# EAGLE design schematic1 (EAGLE 9.6.2)

## Sheet 1 of 2
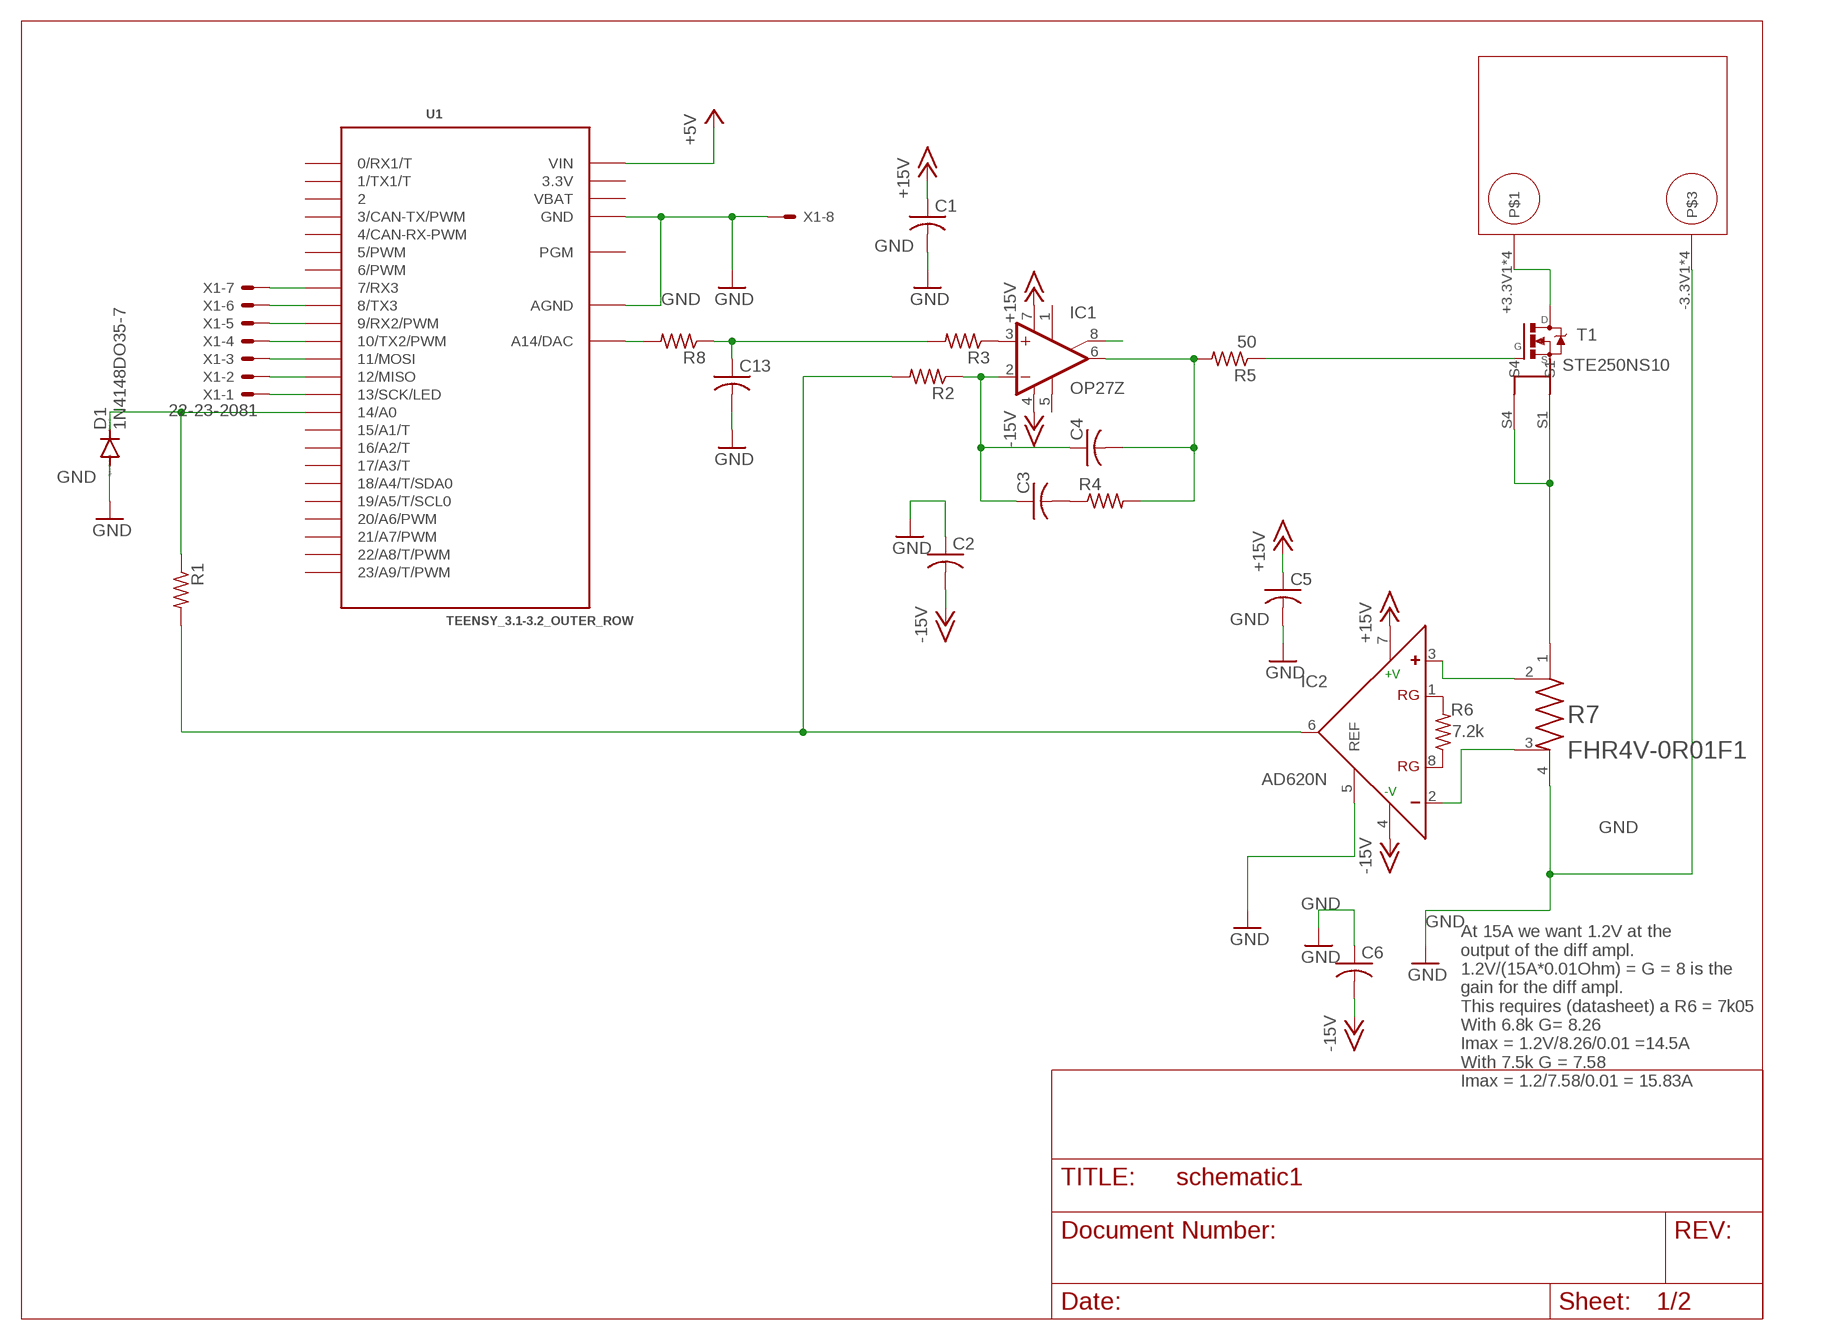
[diagram p0: schematic, sheet 1]

### Parts
C1  C-US025-024X044  [C025-024X044]
C2  C-US025-024X044  [C025-024X044]
C3  C-US025-024X044  [C025-024X044]
C4  C-US025-024X044  [C025-024X044]
C5  C-US025-024X044  [C025-024X044]
C6  C-US025-024X044  [C025-024X044]
C13  C-US025-024X044  [C025-024X044]
D1  1N4148DO35-7  [DO35-7]
IC1  OP27Z  [DIL08]
IC2  AD620N  [DIL08]
J1  MOLEX_0399200502  [3.3V_HOOKIN]
R1  R-US_0204/7  [0204/7]
R2  R-US_0204/7  [0204/7]
R3  R-US_0204/7  [0204/7]
R4  R-US_0204/7  [0204/7]
R5  50  R-US_0204/7  [0204/7]
R6  7.2k  R-US_0204/7  [0204/7]
R7  FHR4V-0R01F1  FHR4V-0R1F1  [RIEDON_FHR4V-0R1F1]
R8  R-US_0204/7  [0204/7]
T1  STE250NS10  [STE250NS10]
U1  TEENSY_3.1-3.2_OUTER_ROW  [TEENSY_3.0-3.2&LC_OUTER_ROW]
X1  22-23-2081  [22-23-2081]

### Nets
+5V: U1.VIN ; also sheet 2
+15V: C1.1 C5.1 IC1.7(V+) IC2.7(+V) ; also sheet 2
-15V: C2.2 C6.2 IC1.4(V-) IC2.4(-V) ; also sheet 2
GND: C1.2 C2.1 C5.2 C6.1 C13.2 D1.A IC2.5(REF) J1.-3.3V1 J1.-3.3V2 J1.-3.3V3 J1.-3.3V4 R7.4 U1.AGND U1.GND U1.GND1(GND) X1.8 ; also sheet 2
N$1: U1.7(7/RX3) X1.7
N$2: J1.+3.3V1 J1.+3.3V2 J1.+3.3V3 J1.+3.3V4 T1.D
N$3: D1.C R1.1 U1.14/A0
N$4: IC2.1(RG) R6.2
N$5: IC2.8(RG) R6.1
N$6: U1.8(8/TX3) X1.6
N$7: IC2.6(OUT) R1.2 R2.2
N$8: C3.1 C4.1 IC1.2(-IN) R2.1
N$9: IC1.3(+IN) R3.1
N$10: R8.2 U1.RESET/DAC(A14/DAC)
N$11: C4.2 IC1.6(OUT) R4.2 R5.2
N$12: R5.1 T1.G
N$13: C3.2 R4.1
N$14: C13.1 R3.2 R8.1
N$15: IC1.8(ON2)
N$16: U1.9(9/RX2/PWM) X1.5
N$17: R7.1 T1.S1 T1.S4
N$18: IC2.3(+) R7.2
N$19: IC2.2(-) R7.3
N$20: U1.10(10/TX2/PWM) X1.4
N$21: U1.11(11/MOSI) X1.3
N$22: U1.12(12/MISO) X1.2
N$23: U1.13(13/SCK/LED) X1.1
Unconnected: IC1.1(ON1) IC1.5(OPT) U1.0(0/RX1/T) U1.1(1/TX1/T) U1.2 U1.3(3/CAN-TX/PWM) U1.4(4/CAN-RX-PWM) U1.5(5/PWM) U1.6(6/PWM) U1.15/A1(15/A1/T) U1.16/A2(16/A2/T) U1.17/A3(17/A3/T) U1.18/A4(18/A4/T/SDA0) U1.19/A5(19/A5/T/SCL0) U1.20/A6(20/A6/PWM) U1.21/A7(21/A7/PWM) U1.22/A8(22/A8/T/PWM) U1.23/A9(23/A9/T/PWM) U1.PGM

### Notes on the sheet
- At 15A we want 1.2V at the
  output of the diff ampl.
  1.2V/(15A*0.01Ohm) = G = 8 is the
  gain for the diff ampl.
  This requires (datasheet) a R6 = 7k05
  With 6.8k G= 8.26
  Imax = 1.2V/8.26/0.01 =14.5A
  With 7.5k G = 7.58
  Imax = 1.2/7.58/0.01 = 15.83A

## Sheet 2 of 2
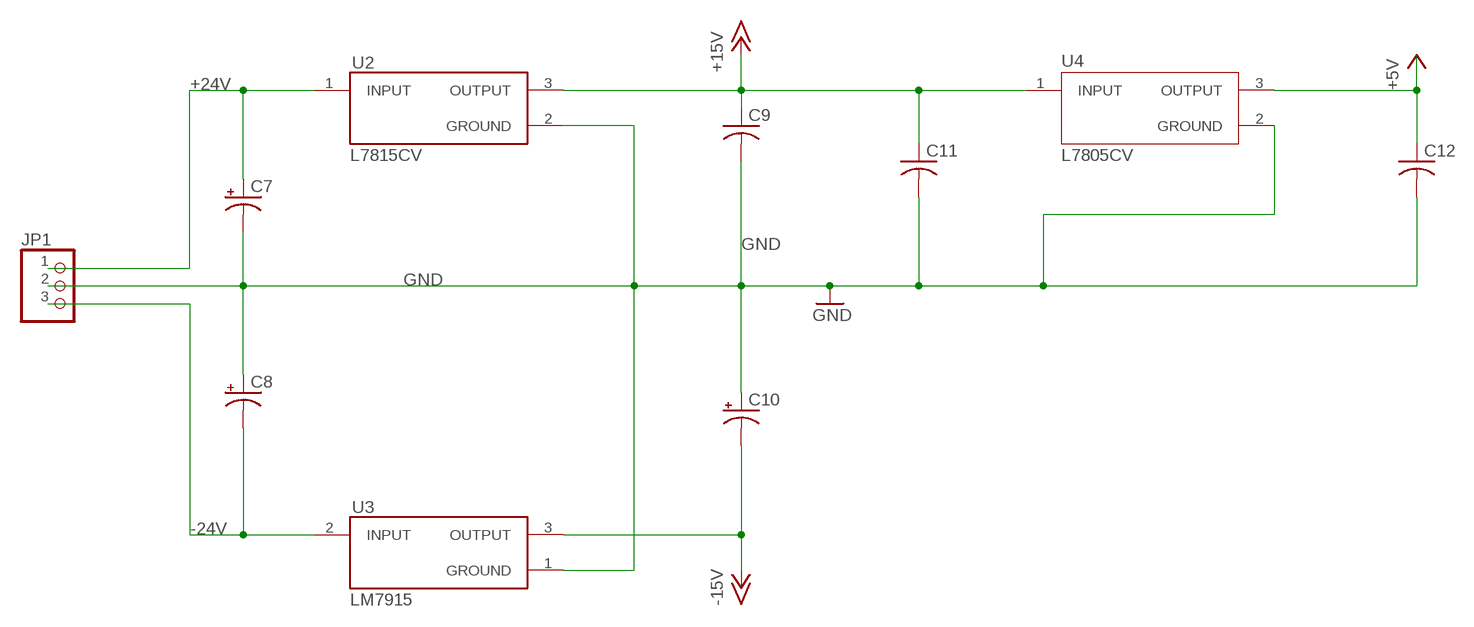
[diagram p1: schematic, sheet 2]

### Parts
C7  CPOL-USTT2D4  [TT2D4]
C8  CPOL-USTT2D4  [TT2D4]
C9  C-US025-024X044  [C025-024X044]
C10  CPOL-USTT2D4  [TT2D4]
C11  C-US025-024X044  [C025-024X044]
C12  C-US025-024X044  [C025-024X044]
JP1  PINHD-1X3  [1X03]
U2  L7815CV  [TO255P1040X460X1935-3]
U3  LM7915  [TO255P1040X460X1935-3]
U4  L7805CV  [TO255P1040X460X1968-3]

### Nets
+5V: C12.1 U4.3(OUTPUT) ; also sheet 1
+15V: C9.1 C11.1 U2.3(OUTPUT) U4.1(INPUT) ; also sheet 1
+24V: C7.+ JP1.1 U2.1(INPUT)
-15V: C10.- U3.3(OUTPUT) ; also sheet 1
-24V: C8.- JP1.3 U3.2(INPUT)
GND: C7.- C8.+ C9.2 C10.+ C11.2 C12.2 JP1.2 U2.2(GROUND) U3.1(GROUND) U4.2(GROUND) ; also sheet 1

## Power pins joined to a net without a drawn wire
3.3V: U1.3.3V U1.3.3V1(3.3V)
VBAT: U1.VBAT

## Library data of the parts
C1-C6 C9 C11-C13 = rcl:C-US: CAPACITOR, American symbol; SPICEPREFIX: C
C7 C8 C10 = rcl:CPOL-US: POLARIZED CAPACITOR, American symbol; SPICEPREFIX: C
D1 = diode:1N4148: DIODE high speed (Philips)
IC1 = schematic1:OP27: OP AMP Check prices <https://pricing.snapeda.com/search/part/OP27/?ref=eda>; AVAILABILITY: Bad; DESCRIPTION: Audio Amplifier 2 Circuit 8-SOIC; MF: Analog Devices; MP: OP27; PACKAGE: SOIC-8 Texas Instruments; PRICE: None
IC2 = schematic1:AD620: Low Cost, Low Power, Instrumentation Amplifier Source: http://www.analog.com/UploadedFiles/Data_Sheets/37793330023930AD620_e.pdf Check prices <https://pricing.snapeda.com/search/part/AD620/?ref=eda>; AVAILABILITY: Bad; DESCRIPTION: Instrumentation Amplifier 1 Circuit 8-SOIC; MF: Analog Devices; MP: AD620; PACKAGE: TSSOP-8 Analog Devices; PRICE: None
J1 = schematic1:MOLEX_0399200502
JP1 = schematic1:PINHD-1X3: PIN HEADER
R1-R6 R8 = rcl:R-US_: RESISTOR, American symbol; SPICEPREFIX: R
R7 = schematic1:FHR4V-0R1F1: RES 0.1 OHM 1% 40W RADIAL Check prices <https://pricing.snapeda.com/search/part/FHR4V-0R1F1/?ref=eda>; AVAILABILITY: Bad; DESCRIPTION: 100 mOhms ±1% 40W Through Hole Resistor 4-SIP Current Sense Metal Foil; MF: Riedon; MP: FHR4V-0R1F1; PACKAGE: SIP-4 Riedon; PRICE: None; PURCHASE-URL: https://pricing.snapeda.com/search/part/FHR4V-0R1F1/?ref=eda
T1 = schematic1:STE250NS10
U1 = schematic1:TEENSY_3.1-3.2_OUTER_ROW: Footprint for Teensy 3.1 or 3.2 board using all pin connections on the outer perimeter
U2 = schematic1:L7815CV: L7815 Series 1.5 A 15 V Fixed Output Three Terminal Voltage Regulator - TO-220 Check prices <https://pricing.snapeda.com/search/part/L7815CV/?ref=eda>; AVAILABILITY: Good; DESCRIPTION: Linear Voltage Regulator IC 1 Output 1.5A TO-220; MF: STMicroelectronics; MP: L7815CV; PACKAGE: TO-220 STMicroelectronics; PRICE: None; PURCHASE-URL: https://pricing.snapeda.com/search/part/L7815CV/?ref=eda
U3 = schematic1:LM7915
U4 = schematic1:L7805CV: Standard Regulator Pos 5V 1.5A 3-Pin(3+Tab) TO-220 Standard Regulator Pos 5V 1.5A 3-Pin(3+Tab) TO-220; AVAILABILITY: Unavailable; DESCRIPTION: Linear Voltage Regulator IC 1 Output 1.5A TO-220; MF: STMicroelectronics; MP: L7805CV; PACKAGE: TO-220 STMicroelectronics; PRICE: None
X1 = schematic1:22-23-2081: .100" (2.54mm) Center Header - 8 Pin; DIGIKEY: ED10566-ND; MF: MOLEX; MPN: 22-23-2081; OC_FARNELL: 1756826; OC_NEWARK: 01C7592

## Board
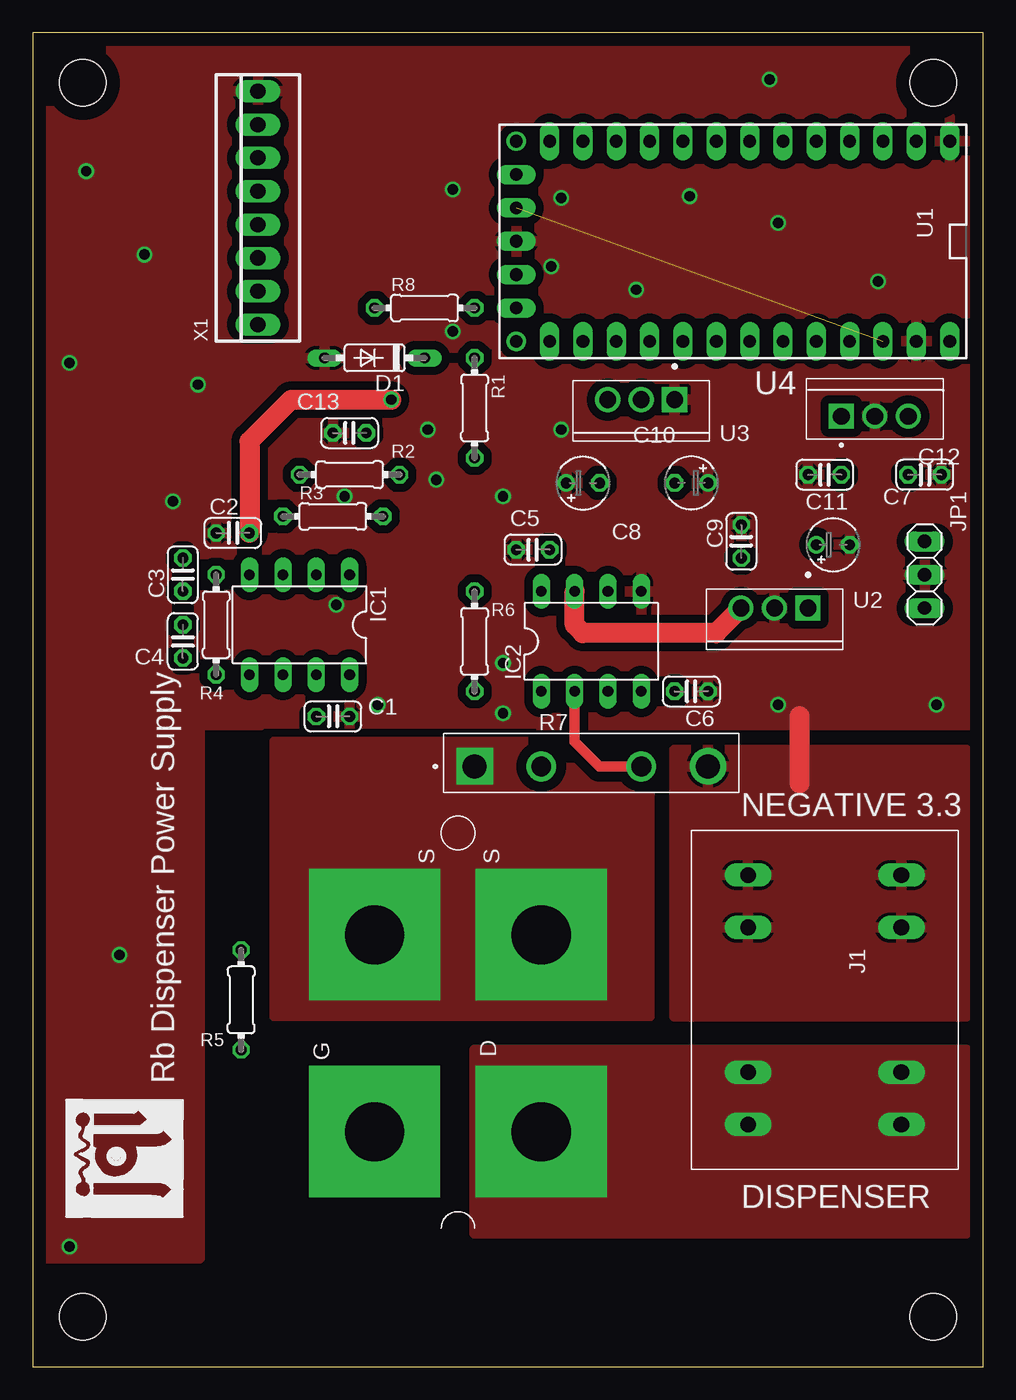
[diagram p2: board, top side]
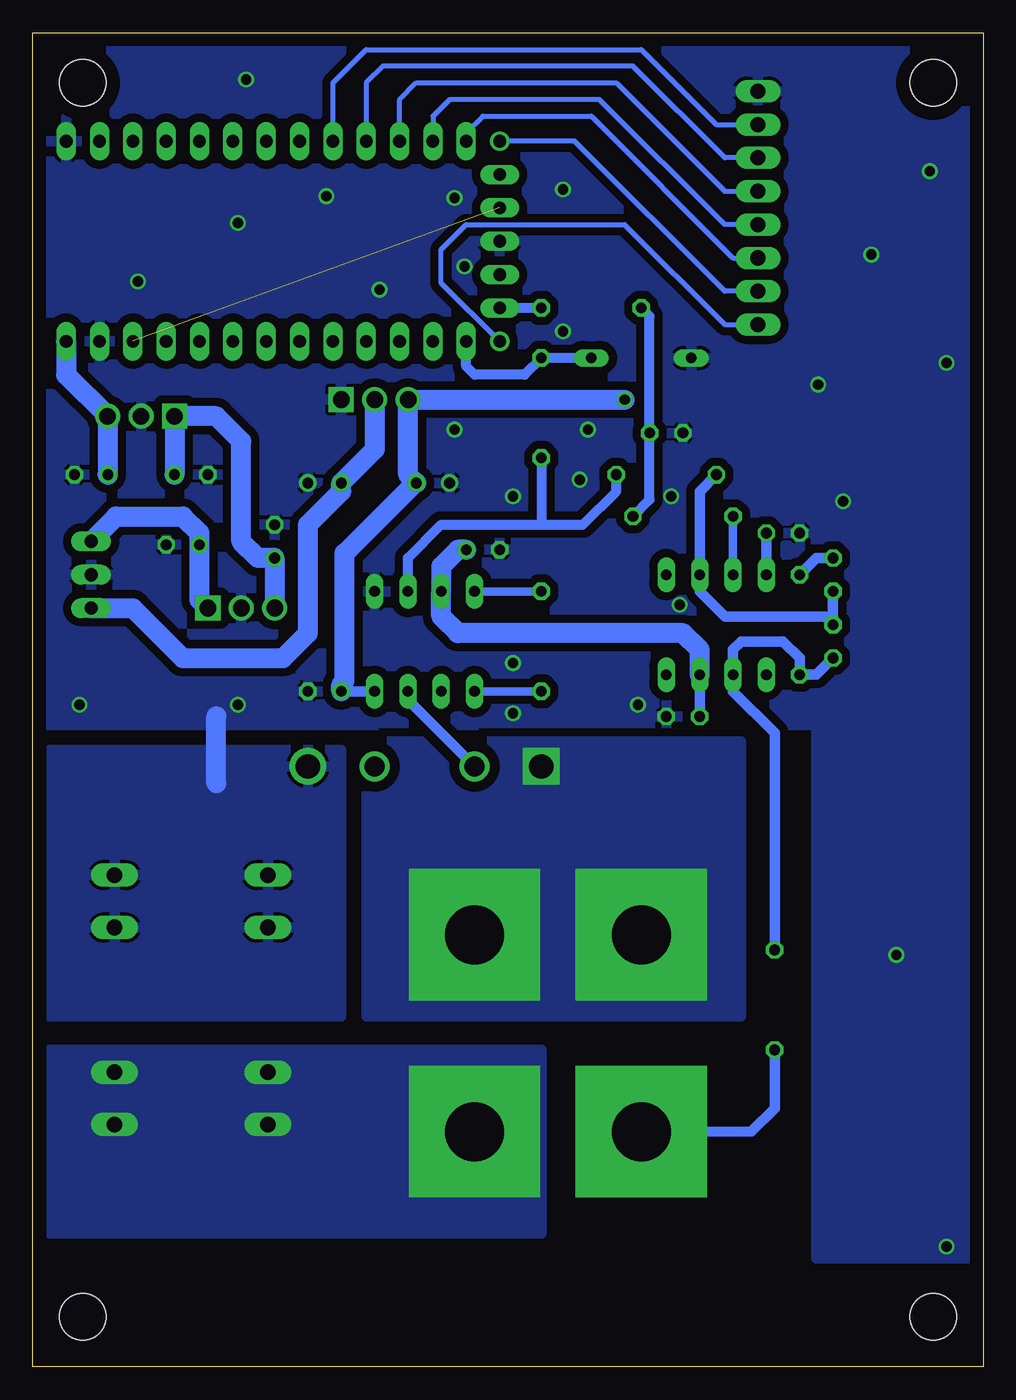
[diagram p3: board, bottom side, seen from below]

Size 72.39 x 101.6 mm. Coordinates in mm from the lower left corner, seen from the top.
Outline: 0,0 72.39,0 72.39,101.6 0,101.6 0,0
Copper layers (1*16): Top 0.035mm / dielectric 1.5mm / Bottom 0.035mm
Design rules "default *": minimum track width 6mil, minimum drill 0.35mm, track to track 10mil, track to pad 10mil, pad to pad 10mil, via to via 10mil, smd to smd 10mil, copper to edge 40mil, drill to drill 6mil, minimum pad ring 10mil, minimum via ring 8mil, stop-mask expansion 4mil, vias tented up to drill 0mil, thermal gap 10mil
Holes 3.56 mm at 3.81,97.79 68.58,97.79 3.81,3.81 68.58,3.81

### Footprints (pad centres in the part's own frame; a part is rotated, then mirrored left to right if it is on the bottom)
C025-024X044 = drill 0.813 octagon: 1 -1.27,0; 2 1.27,0
TT2D4 = drill 0.813: + -1.27,0 | drill 0.813 octagon: - 1.27,0
DO35-7 = drill 0.813 long: A 3.81,0; C -3.81,0
DIL08 = drill 0.813 long: 1 -3.81,-3.81; 2 -1.27,-3.81; 3 1.27,-3.81; 4 3.81,-3.81; 5 3.81,3.81; 6 1.27,3.81; 7 -1.27,3.81; 8 -3.81,3.81
3.3V_HOOKIN = drill 1.194 long: +3.3V1 9.5,-5.842; +3.3V2 5.512,-5.842; +3.3V3 9.5,5.842; +3.3V4 5.512,5.842; -3.3V1 -5.512,-5.842; -3.3V2 -9.5,-5.842; -3.3V3 -5.512,5.842; -3.3V4 -9.5,5.842
1X03 = drill 1.016 long: 1 -2.54,0; 2 0,0; 3 2.54,0
0204/7 = drill 0.813 octagon: 1 -3.81,0; 2 3.81,0
RIEDON_FHR4V-0R1F1 = drill 1.85 square: 1 -8.89,0 | drill 1.51: 2 -3.81,0; 3 3.81,0 | drill 1.85: 4 8.89,0
STE250NS10 = drill 4.5 pad 10 square: D 7.5,6.35; G 7.5,-6.35; S1 -7.5,-6.35; S4 -7.5,6.35
TEENSY_3.0-3.2&LC_OUTER_ROW = drill 0.965 long: 0 -7.62,13.97; 1 -7.62,11.43; 2 -7.62,8.89; 3 -7.62,6.35; 3.3V 7.62,11.43; 3.3V1 -2.54,-16.51; 4 -7.62,3.81; 5 -7.62,1.27; 6 -7.62,-1.27; 7 -7.62,-3.81; 8 -7.62,-6.35; 9 -7.62,-8.89; 10 -7.62,-11.43; 11 -7.62,-13.97; 14/A0 7.62,-13.97; 15/A1 7.62,-11.43; 16/A2 7.62,-8.89; 17/A3 7.62,-6.35; 18/A4 7.62,-3.81; 19/A5 7.62,-1.27; 20/A6 7.62,1.27; 21/A7 7.62,3.81; 22/A8 7.62,6.35; 23/A9 7.62,8.89; AGND 7.62,13.97; GND -7.62,16.51; GND1 0,-16.51; PGM 2.54,-16.51; RESET/DAC 5.08,-16.51; VBAT -5.08,-16.51; VIN 7.62,16.51 | drill 0.965: 12 -7.62,-16.51; 13 7.62,-16.51
TO255P1040X460X1935-3 = drill 1.27 pad 1.91 square: 1 0,0 | drill 1.27 pad 1.91: 2 2.55,0; 3 5.1,0
TO255P1040X460X1968-3 = drill 1.27 pad 1.91 square: 1 0,0 | drill 1.27 pad 1.91: 2 2.55,0; 3 5.1,0
22-23-2081 = drill 1.143 long: 1 -8.89,0; 2 -6.35,0; 3 -3.81,0; 4 -1.27,0; 5 1.27,0; 6 3.81,0; 7 6.35,0; 8 8.89,0

### Placement (x,y rotation side)
C1  22.86,49.53 0 top
C2  15.24,63.5 0 top
C3  11.43,60.33 90 top
C4  11.43,55.24 270 top
C5  38.1,62.23 180 top
C6  50.16,51.44 180 top
C7  60.96,62.61 0 top
C8  50.16,67.31 180 top
C9  53.98,62.87 90 top
C10  41.91,67.31 0 top
C11  60.33,67.94 180 top
C12  67.94,67.94 0 top
C13  24.13,71.12 180 top
D1  26.04,76.83 180 top
IC1  20.32,56.52 180 top
IC2  42.55,55.24 0 top
J1  60.33,27.94 270 top
JP1  67.94,60.33 270 top
LOGO1  JQI-LOGOSILK  [JQI_LOGO_NEGATIVE-SILKSCREEN]  11.43,11.43 90 top
R1  33.66,73.03 270 top
R2  24.13,67.94 0 top
R3  22.86,64.77 0 top
R4  13.97,56.52 270 top
R5  15.88,27.94 90 top
R6  33.66,55.24 270 top
R7  FHR4V-0R1F1  [RIEDON_FHR4V-0R1F1]  42.55,45.72 0 top
R8  29.84,80.64 0 top
T1  32.38,25.4 270 top
U1  53.34,85.72 270 top
U2  59.05,57.78 180 top
U3  48.9,73.66 180 top
U4  61.59,72.39 0 top
X1  17.14,88.27 90 top

### Tracks (layer width: path | path; a pad name or v marks a point on that pad's centre or on a via)
3.3V  (1 unrouted)
+5V
  Bottom 1.524: C12.1 66.69,67.97 U4.3 69.85,75.55 U1.VIN
+15V
  Top 1.524: U2.3 52.05,55.88 41.91,55.88 41.27,56.52 IC2.7
  Bottom 0.813: C1.1 IC1.7
  Bottom 1.524: C11.1 U4.1 58.42,72.39 56.52,70.48 56.52,62.87 55.24,61.59 C9.1 53.98,57.8 U2.3 | IC1.7 21.59,54.61 22.86,55.88 40.01,55.88 41.27,57.15 IC2.7 41.27,60.96 40.01,62.23 C5.1
+24V
  Bottom 1.524: JP1.1 66.04,64.77 60.96,64.77 59.69,63.5 C7.+ 59.69,58.42 U2.1
-15V  (via drill 0.79)
  Top 1.524: v27.3,73.66 19.68,73.66 16.51,70.48 C2.2
  Bottom 0.813: IC1.4 C2.2 | C6.2 IC2.4
  Bottom 1.524: v27.3,73.66 U3.3 43.8,67.92 C10.- 43.28,67.31 48.64,61.95 48.64,52.2 48.9,51.94 C6.2
-24V
  Bottom 1.524: JP1.3 64.77,57.78 60.96,53.98 53.34,53.98 51.44,55.88 51.44,64.14 48.9,66.67 C8.- 46.34,69.86 U3.2
GND  (via drill 0.79)
  Top 1.524: 58.42,44.45 58.42,49.53
  Bottom 1.524: 58.42,44.45 58.42,49.53
  other vias: 12.57,74.8 10.67,65.91 30.1,71.37 30.73,67.56 40.26,71.37 35.81,66.29 35.81,53.59 35.81,49.78 26.29,50.42 56.77,50.42 68.83,50.42 4.06,91.06 2.79,76.45 8.51,84.71 56.13,98.04 2.79,9.14 6.6,31.37 50.04,89.15 39.5,83.82 40.26,89.03 32,89.66 56.77,87.12 64.39,82.68 45.97,82.04 32,78.87 23.75,66.29 23.11,58.04
  pour Bottom (isolate 0.635, rank 2): 0,100.97 72.39,100.97 72.39,48.9 12.7,48.9 12.7,8.26 0,8.26
  pour Top (isolate 0.635, rank 2): 0,100.97 72.39,100.97 72.39,48.9 12.7,48.9 12.7,8.26 0,8.26
  pour Top (isolate 0.635): 48.9,26.67 48.9,46.99 71.12,46.99 71.12,26.67
  pour Bottom (isolate 0.635): 48.9,26.67 48.9,46.99 71.12,46.99 71.12,26.67
N$1
  Bottom 0.381: X1.7 20.32,94.61 26.04,100.33 46.99,100.33 49.53,97.79 U1.7
N$2
  pour Bottom (no thermals): 33.66,10.16 33.66,24.13 71.12,24.13 71.12,10.16
  pour Top (no thermals): 33.66,10.16 33.66,24.13 71.12,24.13 71.12,10.16
N$3
  Bottom 0.762: D1.C R1.1 34.92,75.56 38.73,75.56 39.37,76.2 U1.14/A0
N$4
  Bottom 0.635: R6.2 IC2.1
N$5
  Bottom 0.635: R6.1 IC2.8
N$6
  Bottom 0.381: X1.6 19.68,92.08 26.67,99.06 45.72,99.06 46.99,97.79 U1.8
N$7
  Bottom 0.762: IC2.6 43.81,61.59 41.27,64.14 33.66,64.14 | R2.2 27.94,66.67 30.48,64.14 33.66,64.14 | R1.2 33.66,64.14
N$8
  Bottom 0.813: C3.1 C4.1 12.06,57.15 19.68,57.15 21.59,59.05 IC1.2 21.59,66.67 R2.1
N$9
  Bottom 0.635: R3.1 IC1.3
N$10
  Bottom 0.762: R8.2 U1.RESET/DAC
N$11
  Bottom 0.813: C4.2 12.7,52.7 R4.2 13.97,53.98 15.24,55.24 18.41,55.24 19.05,54.61 IC1.6 19.05,51.44 15.88,48.26 R5.2
N$12
  Bottom 0.813: R5.1 15.88,19.68 17.65,17.91 T1.G
N$13
  Bottom 0.813: R4.1 12.7,61.59 C3.2
N$14
  Bottom 0.762: R3.2 25.4,66.04 C13.1 25.4,80.01 R8.1
N$16
  Bottom 0.381: X1.5 19.68,89.53 27.94,97.79 43.18,97.79 44.45,96.52 U1.9
N$17
  pour Bottom (isolate 0.762, no thermals): 46.99,26.67 18.41,26.67 18.41,47.62 46.99,47.62
  pour Top (isolate 0.762, no thermals): 46.99,26.67 18.41,26.67 18.41,47.62 46.99,47.62
N$18
  Bottom 0.813: R7.2 43.81,50.8 IC2.3
N$19
  Top 0.813: R7.3 43.18,45.72 41.27,47.62 IC2.2
N$20
  Bottom 0.381: X1.4 19.68,87 29.21,96.52 40.64,96.52 41.91,95.25 U1.10
N$21
  Bottom 0.381: U1.11 39.37,93.98 38.1,95.25 29.84,95.25 19.05,84.45 X1.3
N$22
  Bottom 0.381: X1.2 19.68,81.92 31.11,93.34 U1.12
N$23
  Bottom 0.381: U1.13 41.27,82.55 41.27,85.09 39.37,87 27.3,87 19.68,79.38 X1.1

### Text on the board
tNames: NEGATIVE 3.3 | Rb Dispenser Power Supply | DISPENSER